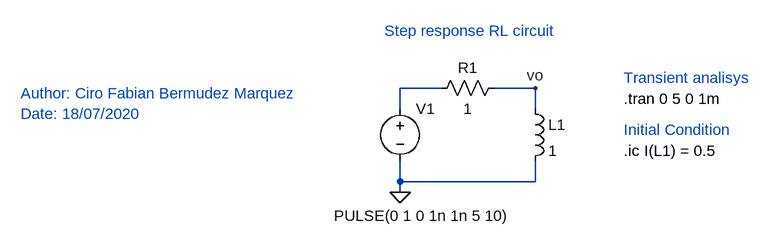
[diagram p0: schematic Step_response_RL.asc]
Step_response_RL.asc, the LTspice schematic file:
Version 4
SHEET 1 880 680
WIRE 32 96 -32 96
WIRE 176 96 112 96
WIRE -32 128 -32 96
WIRE 176 128 176 96
WIRE -32 240 -32 208
WIRE 176 240 176 208
WIRE 176 240 -32 240
WIRE -32 256 -32 240
FLAG -32 256 0
FLAG 176 96 vo
SYMBOL voltage -32 112 R0
WINDOW 3 -102 180 Left 2
WINDOW 123 0 0 Left 0
WINDOW 39 0 0 Left 0
SYMATTR Value PULSE(0 1 0 1n 1n 5 10)
SYMATTR InstName V1
SYMBOL res 16 112 R270
WINDOW 0 32 56 VTop 2
WINDOW 3 0 56 VBottom 2
SYMATTR InstName R1
SYMATTR Value 1
SYMBOL ind 160 112 R0
SYMATTR InstName L1
SYMATTR Value 1
TEXT -616 104 Left 2 ;Author: Ciro Fabian Bermudez Marquez\nDate: 18/07/2020
TEXT -56 8 Left 2 ;Step response RL circuit
TEXT 312 80 Left 2 ;Transient analisys
TEXT 312 112 Left 2 !.tran 0 5 0 1m
TEXT 312 192 Left 2 !.ic I(L1) = 0.5
TEXT 312 160 Left 2 ;Initial Condition

The netlist it stands for:
* Step_response_RL.asc
V1 N001 0 PULSE(0 1 0 1n 1n 5 10)
R1 N001 vo 1
L1 vo 0 1
* Author: Ciro Fabian Bermudez Marquez
* Date: 18/07/2020
* Step response RL circuit
* Transient analisys
.tran 0 5 0 1m
.ic I(L1) = 0.5
* Initial Condition
.backanno
.end